# Altium schematic sheet Clock.SchDoc
size A4; SheetNumber: 4; SheetTotal: 7
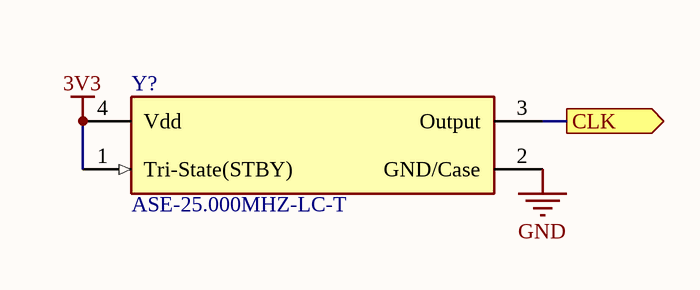
[diagram p0: Clock.SchDoc]

## Parts
Y?  ASE-25.000MHZ-LC-T

## Ports
CLK (out)

## Nets
3V3: Y?.1(Tri-State(STBY)) Y?.4(Vdd)
GND: Y?.2(GND/Case)
CLK: Y?.3(Output) ; port CLK

## Library data of the parts
Y? = OC_SMD_4MHz_3V3_ASE: XTAL OSC XO 25.0000MHZ CMOS SMD; ComponentLink1Description: Datasheet; ComponentLink1URL: https://abracon.com/Oscillators/ASEseries.pdf